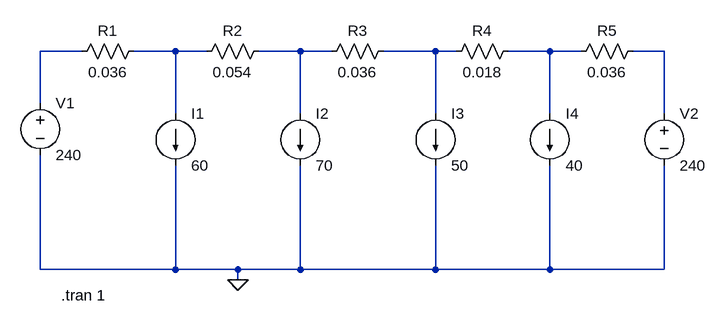
[diagram p0: schematic DC_Both_Ends.asc]
DC_Both_Ends.asc, the LTspice schematic file:
Version 4
SHEET 1 1112 680
WIRE -16 -32 -80 -32
WIRE 128 -32 64 -32
WIRE 176 -32 128 -32
WIRE 320 -32 256 -32
WIRE 368 -32 320 -32
WIRE 528 -32 448 -32
WIRE 560 -32 528 -32
WIRE 704 -32 640 -32
WIRE 752 -32 704 -32
WIRE 880 -32 832 -32
WIRE -80 48 -80 -32
WIRE 128 64 128 -32
WIRE 320 64 320 -32
WIRE 528 64 528 -32
WIRE 704 64 704 -32
WIRE 880 64 880 -32
WIRE -80 304 -80 128
WIRE 128 304 128 144
WIRE 128 304 -80 304
WIRE 224 304 128 304
WIRE 320 304 320 144
WIRE 320 304 224 304
WIRE 528 304 528 144
WIRE 528 304 320 304
WIRE 704 304 704 144
WIRE 704 304 528 304
WIRE 880 304 880 144
WIRE 880 304 704 304
WIRE 224 320 224 304
FLAG 224 320 0
SYMBOL voltage -80 32 R0
WINDOW 123 0 0 Left 0
WINDOW 39 0 0 Left 0
SYMATTR InstName V1
SYMATTR Value 240
SYMBOL voltage 880 48 R0
WINDOW 123 0 0 Left 0
WINDOW 39 0 0 Left 0
SYMATTR InstName V2
SYMATTR Value 240
SYMBOL res -32 -16 R270
WINDOW 0 32 56 VTop 2
WINDOW 3 0 56 VBottom 2
SYMATTR InstName R1
SYMATTR Value 0.036
SYMBOL res 160 -16 R270
WINDOW 0 32 56 VTop 2
WINDOW 3 0 56 VBottom 2
SYMATTR InstName R2
SYMATTR Value 0.054
SYMBOL res 848 -48 R90
WINDOW 0 0 56 VBottom 2
WINDOW 3 32 56 VTop 2
SYMATTR InstName R5
SYMATTR Value 0.036
SYMBOL res 464 -48 R90
WINDOW 0 0 56 VBottom 2
WINDOW 3 32 56 VTop 2
SYMATTR InstName R3
SYMATTR Value 0.036
SYMBOL res 656 -48 R90
WINDOW 0 0 56 VBottom 2
WINDOW 3 32 56 VTop 2
SYMATTR InstName R4
SYMATTR Value 0.018
SYMBOL current 128 64 R0
WINDOW 123 0 0 Left 0
WINDOW 39 0 0 Left 0
SYMATTR InstName I1
SYMATTR Value 60
SYMBOL current 320 64 R0
WINDOW 123 0 0 Left 0
WINDOW 39 0 0 Left 0
SYMATTR InstName I2
SYMATTR Value 70
SYMBOL current 528 64 R0
WINDOW 123 0 0 Left 0
WINDOW 39 0 0 Left 0
SYMATTR InstName I3
SYMATTR Value 50
SYMBOL current 704 64 R0
WINDOW 123 0 0 Left 0
WINDOW 39 0 0 Left 0
SYMATTR InstName I4
SYMATTR Value 40
TEXT -48 344 Left 2 !.tran 1

The netlist it stands for:
* DC_Both_Ends.asc
V1 N001 0 240
V2 N006 0 240
R1 N001 N002 0.036
R2 N002 N003 0.054
R5 N006 N005 0.036
R3 N004 N003 0.036
R4 N005 N004 0.018
I1 N002 0 60
I2 N003 0 70
I3 N004 0 50
I4 N005 0 40
.tran 1
.backanno
.end